# Altium schematic sheet OUTPUT_RELAY.SchDoc
size A
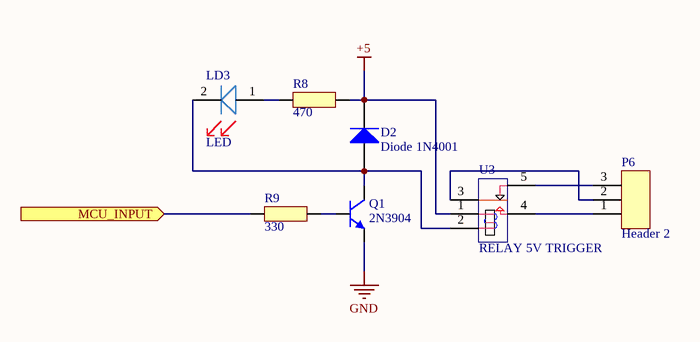
[diagram p0: OUTPUT_RELAY.SchDoc]

## Parts
D2  Diode 1N4001  [DO-41]
LD3  LED  [LED_SMD]
P6  Header 2  [3 PIN TERMINAL]
Q1  2N3904  [SOT23C]
R8  470  [Resistor]
R9  330  [Resistor]
U3  RELAY 5V TRIGGER  [RELAY 5V TRIGGER]

## Ports
MCU_INPUT (in)

## Nets
+5: D2.2(K) R8.1 U3.1
GND: Q1.1(E)
MCU_INPUT: R9.1 ; port MCU_INPUT
NetD2_1: D2.1(A) LD3.2 Q1.3(C) U3.2
NetLD3_1: LD3.1 R8.2
NetP6_1: P6.1 U3.4
NetP6_2: P6.2 U3.3
NetP6_3: P6.3 U3.5
NetQ1_2: Q1.2(B) R9.2

## Library data of the parts
D2 = Diode 1N4001: 1 Amp General Purpose Rectifier; Published: 8-Jun-2000; LatestRevisionDate: 17-Jul-2002; LatestRevisionNote: Re-released for DXP Platform.; DatasheetVersion: 1998; PackageVersion: Aug-1999; PackageReference: DO-41; Publisher: Altium Limited; PackageDescription: Diode, Axial; Body 5.2 x 2.7 mm (LxDia. max), Lead Dia. 0.86 mm (max); Code_JEDEC: DO-204-AL; ComponentLink1Description: Manufacturer Link; ComponentLink1URL: http://www.fairchildsemi.com/; ComponentLink2Description: Datasheet; ComponentLink2URL: http://www.fairchildsemi.com/ds/1N%2F1N4001.pdf
LD3 = LED_SMD: 0805; LatestRevisionDate: 17-Jul-2002; LatestRevisionNote: Re-released for DXP Platform.; Publisher: Altium Limited
P6 = 3 PIN TERMINAL: Header, 2-Pin; LatestRevisionDate: 17-Jul-2002; LatestRevisionNote: Re-released for DXP Platform.; Publisher: Altium Limited
Q1 = 2N3904: NPN General Purpose Amplifier; Published: 8-Jun-2000; LatestRevisionDate: 15-Jan-2003; LatestRevisionNote: PCB Footprint 'BCY-W3/D4.7' replaced; DatasheetDocument: 1997; PackageDocument: Sep-1998; PackageReference: TO-92A; Publisher: Altium Limited; Code_JEDEC: TO-92A; ComponentLink1Description: Manufacturer Link; ComponentLink1URL: http://www.fairchildsemi.com/; ComponentLink2Description: Datasheet; ComponentLink2URL: http://www.fairchildsemi.com/ds/2N%2F2N3904.pdf
R8 R9 = Resistor: LatestRevisionDate: 17-Jul-2002; LatestRevisionNote: Re-released for DXP Platform.; Publisher: Altium Limited
  R8: Value: 470
  R9: Value: 330
U3 = RELAY 5V TRIGGER: Header, 2-Pin; LatestRevisionDate: 17-Jul-2002; LatestRevisionNote: Re-released for DXP Platform.; Publisher: Altium Limited